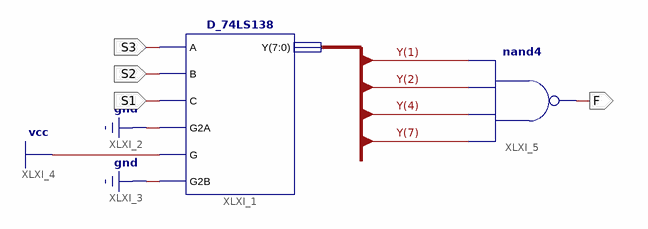
[diagram p0: schematic sheet 1]
// Xilinx ISE schematic LampCtrl138.sch (kintex7) as structural Verilog: 2 symbols, 4 ports
module LampCtrl138 (
  input  S3,
  input  S2,
  input  S1,
  output F
);

  wire [7:0] Y;

  nand XLXI_5 (F, Y[7], Y[4], Y[2], Y[1]);
  D_74LS138 XLXI_1 (.A(S3), .B(S2), .C(S1), .G2A(1'b0), .G(1'b1), .G2B(1'b0), .Y(Y));
endmodule
